# Altium schematic sheet 屏幕挂灯原理图.SchDoc
size A4
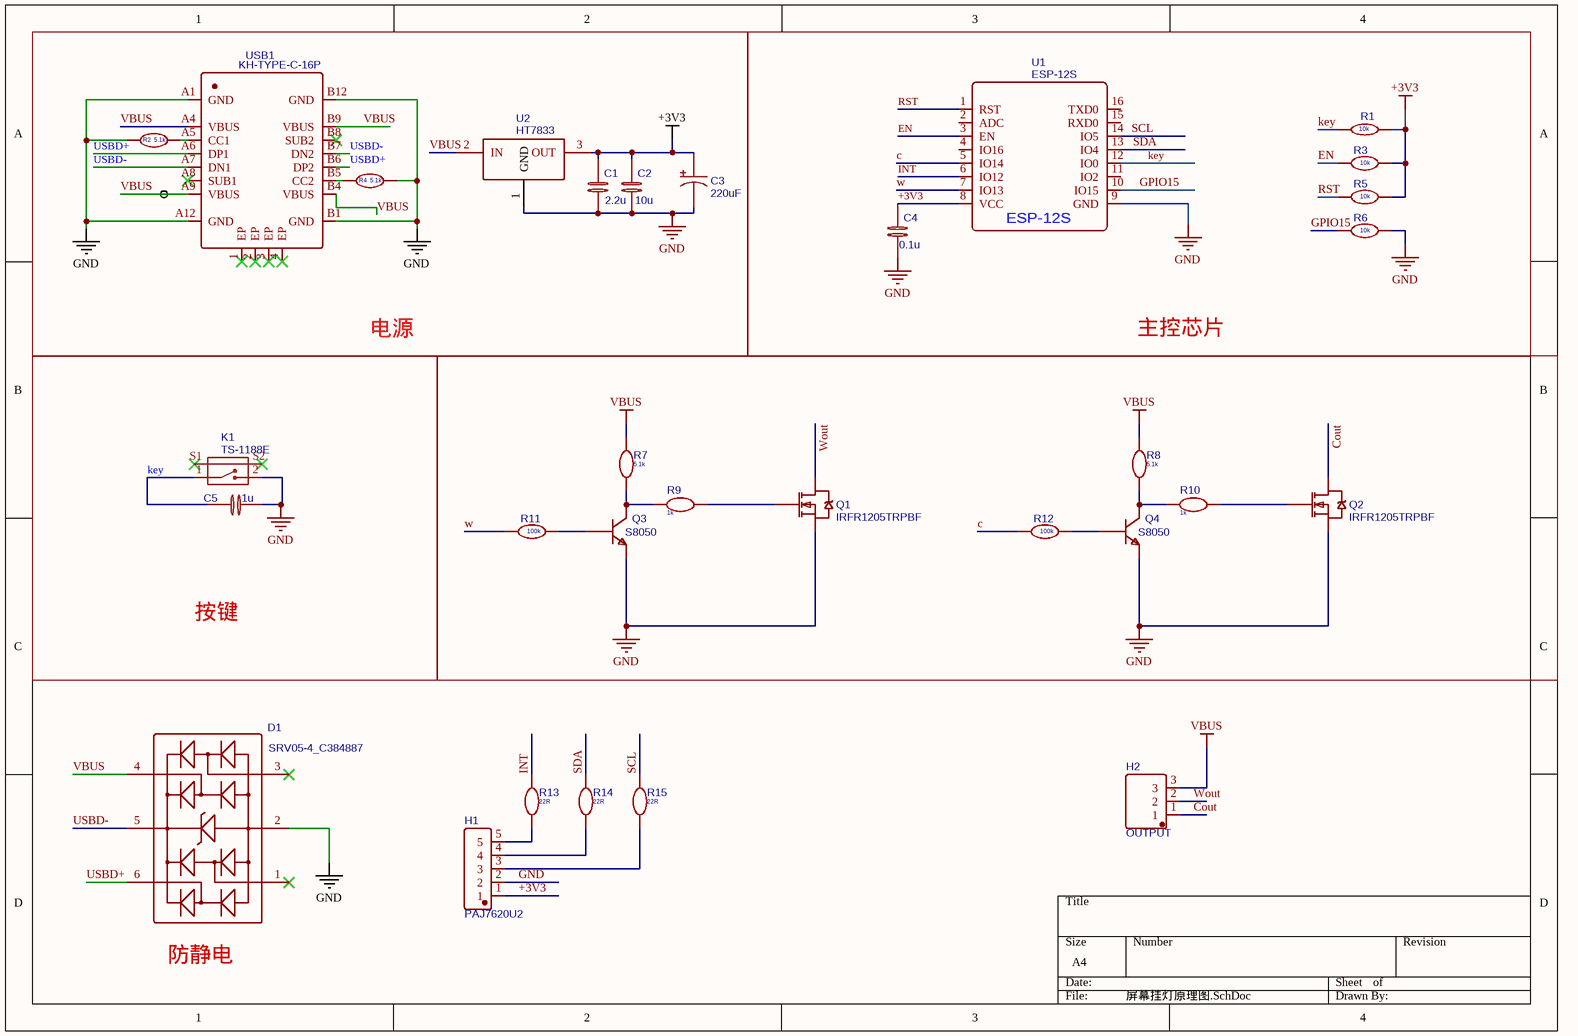
[diagram p0: 屏幕挂灯原理图.SchDoc]

## Parts
C1  2.2u  [C0603]
C2  10u  [C0603]
C3  220uF  [CAP-SMD_BD5.0-L5.3-W5.3-FD]
C4  0.1u  [C0603]
C5  1u  [C0603]
D1  SRV05-4_C384887  [SOT-23-6_L2.9-W1.6-P0.95-LS2.8-BR]
H1  PAJ7620U2  [HDR-TH_5P-P2.54-V-M]
H2  OUTPUT  [HDR-TH_3P-P2.54-V-M-1]
K1  TS-1188E  [SMD SWITCH 7X3.6X2.7]
Q1  IRFR1205TRPBF  [TO-252-2_L6.5-W6.1-P4.58-LS10.0-TR]
Q2  IRFR1205TRPBF  [TO-252-2_L6.5-W6.1-P4.58-LS10.0-TR]
Q3  S8050  [SOT-23(SOT-23-3)]
Q4  S8050  [SOT-23(SOT-23-3)]
R1  10k  [R0603]
R2  5.1k  [R0603]
R3  10k  [R0603]
R4  5.1k  [R0603]
R5  10k  [R0603]
R6  10k  [R0603]
R7  5.1k  [R0603]
R8  5.1k  [R0603]
R9  1k  [R0603]
R10  1k  [R0603]
R11  100k  [R0603]
R12  100k  [R0603]
R13  22R  [R0603]
R14  22R  [R0603]
R15  22R  [R0603]
U1  ESP-12S  [WIFIM-SMD_ESP-12F-ESP8266MOD]
U2  HT7833  [SOT-89_L4.5-W2.5-P1.50-LS4.2-BR]
USB1  KH-TYPE-C-16P  [USB-C-SMD_KH-TYPE-C-16P]

## Blocks framed on the sheet
电源: C1-C3 R2 R4 U2 USB1
主控芯片: C4 R1 R3 R5 R6 U1

## Nets
+3V3: C1.2 C2.2 C3.1 C4.2 H1.1 R1.1 R3.2 R5.2 U1.8(VCC) U2.3(OUT)
GND: C1.1 C2.1 C3.2 C4.1 C5.1 D1.2(GND) H1.2 K1.2 Q1.3(S) Q2.3(S) Q3.2(E) Q4.2(E) R2.1 R4.2 R6.2 U1.9(GND) U2.1(GND) USB1.A1(GND) USB1.A12(GND) USB1.B1(GND) USB1.B12(GND)
VBUS: D1.4(IO4) H2.3 R7.2 R8.2 U2.2(IN) USB1.A4(VBUS) USB1.A9(VBUS) USB1.B4(VBUS) USB1.B9(VBUS)
c: R12.1 U1.5(IO14)
Cout: H2.1 Q2.4(D)
EN: R3.1 U1.3(EN)
GPIO15: R6.1 U1.10(IO15)
INT: R13.2 U1.6(IO12)
key: C5.2 K1.1 R1.2 U1.12(IO0)
RST: R5.1 U1.1(RST)
SCL: R15.2 U1.14(IO5)
SDA: R14.2 U1.13(IO4)
USBD+: D1.6(IO2) USB1.A6(DP1) USB1.B6(DP2)
USBD-: D1.5(VCC) USB1.A7(DN1) USB1.B7(DN2)
w: R11.1 U1.7(IO13)
Wout: H2.2 Q1.4(D)
NetH1_3: H1.3 R15.1
NetH1_4: H1.4 R14.1
NetH1_5: H1.5 R13.1
NetQ1_1: Q1.1(G) R9.1
NetQ2_1: Q2.1(G) R10.1
NetQ3_1: Q3.1(B) R11.2
NetQ3_3: Q3.3(C) R7.1 R9.2
NetQ4_1: Q4.1(B) R12.2
NetQ4_3: Q4.3(C) R8.1 R10.2
NetR2_2: R2.2 USB1.A5(CC1)
NetR4_1: R4.1 USB1.B5(CC2)

Not connected (* = marked no-connect by the designer): D1 1(IO1)* 3(IO3)*; K1 S1* S2*; U1 2(ADC) 4(IO16) 11(IO2) 15(RXD0) 16(TXD0); USB1 1(EP)* 2(EP)* 3(EP)* 4(EP)* A8(SUB1)* B8(SUB2)*

## Notes on the sheet
- 按键
- 防静电

## Library data of the parts
C1 = 2.2u: nameAlias: Value(F); Contributor: LCEDA_Lib; spicePre: C; spiceSymbolName: C_0603_EU
C2 = 10u: nameAlias: Value(F); Contributor: LCEDA_Lib; spicePre: C; spiceSymbolName: C_0603_EU
C3 = 220uF: BOM_Manufacturer: PANASONIC; BOM_Manufacturer Part: EEEFT0J221AR; nameAlias: Capacitance; Contributor: LCSC; BOM_Supplier: LCSC; BOM_Supplier Part: C336271; BOM_JLCPCB Part Class: Extended Part; spicePre: C; spiceSymbolName: EEEFT0J221AR
C4 = 0.1u: nameAlias: Value(F); Contributor: LCEDA_Lib; spicePre: C; spiceSymbolName: C_0603_EU
C5 = 1u: nameAlias: Value(F); Contributor: LCEDA_Lib; spicePre: C; spiceSymbolName: C_0603_EU
D1 = SRV05-4_C384887: BOM_Manufacturer: Leiditech; Contributor: LCSC; BOM_Paste Type: expand; BOM_Supplier: LCSC; BOM_Supplier Part: C384887; BOM_Manufacturer Part: SRV05-4; spicePre: D; spiceSymbolName: SRV05-4_C384887
H1 = KH-2.54PH180-1X5P-L11.5: BOM_Manufacturer: kinghelm(金航标); Contributor: LCSC; BOM_Supplier: LCSC; BOM_Supplier Part: C2932699; BOM_Manufacturer Part: KH-2.54PH180-1X5P-L11.5; BOM_JLCPCB Part Class: Extended Part; spicePre: H; spiceSymbolName: KH-2.54PH180-1X5P-L11.5
H2 = 68000-103HLF: BOM_Manufacturer: Amphenol ICC; Contributor: LCSC; BOM_Supplier: LCSC; BOM_Supplier Part: C168677; BOM_Manufacturer Part: 68000-103HLF; BOM_JLCPCB Part Class: Extended Part; spicePre: H; spiceSymbolName: 68000-103HLF
K1 = TS-1188E: BOM_Manufacturer: ReliaPro; BOM_Manufacturer Part: 3*6*3.5 Side press  High temperature; catid: 20; spicePre: K; BOM_Supplier: LCSC; BOM_Supplier Part: C37327
Q1 Q2 = IRFR1205TRPBF: BOM_Manufacturer: Infineon; BOM_Supplier: LCSC; BOM_Manufacturer Part: IRFR1205TRPBF; BOM_Supplier Part: C81467; BOM_JLCPCB Part Class: Extended Part; spicePre: Q; spiceSymbolName: IRFR1205TRPBF
Q3 Q4 = S8050: BOM_Manufacturer: Yenji; Contributor: LCSC; SMT Type: Extend; BOM_Supplier: LCSC; BOM_Manufacturer Part: S8050; BOM_Supplier Part: C139514; BOM_LCSC Assembly: Yes; spicePre: Q
R1 = 10k: BOM_Manufacturer Part: CRCW060310K0JNEA; BOM_Manufacturer: Vishay Intertech; nameAlias: Value(Ω); spicePre: R; spiceSymbolName: Resistor; BOM_Supplier: LCSC; BOM_Supplier Part: C169103
R2 R4 = 5.1k: nameAlias: Value(Ω); Contributor: LCEDA_Lib; spicePre: R; spiceSymbolName: R_0603_EU
R3 R5-R15 = NC: nameAlias: Value(Ω); Contributor: LCEDA_Lib; spicePre: R; spiceSymbolName: R_0603_EU
U1 = ESP-12S: BOM_Manufacturer: Ai-Thinker; Contributor: HalfSweet; SMT Type: Extend; BOM_Supplier: LCSC; BOM_Manufacturer Part: ESP-12S; BOM_Supplier Part: C82898; BOM_JLCPCB SMD: Yes; spicePre: U; spiceSymbolName: ESP-12S
U2 = HT7833: BOM_Manufacturer: HOLTEK; SMT Type: Extend; BOM_Supplier: LCSC; BOM_Manufacturer Part: HT7833; image: //image.lceda.cn/szlcsc/C50936.jpg; BOM_Supplier Part: C50936; BOM_JLCPCB SMD: Yes; spicePre: U; spiceSymbolName: HT7833
USB1 = KH-TYPE-C-16P: BOM_Manufacturer: Shenzhen Kinghelm Elec; Contributor: LCSC; BOM_Supplier: LCSC; BOM_Supplier Part: C709357; BOM_Manufacturer Part: KH-TYPE-C-16P; spicePre: U; spiceSymbolName: KH-TYPE-C-16P